# EAGLE design BRD161224 (EAGLE 8.2.2)
BOARD: BLE2 click
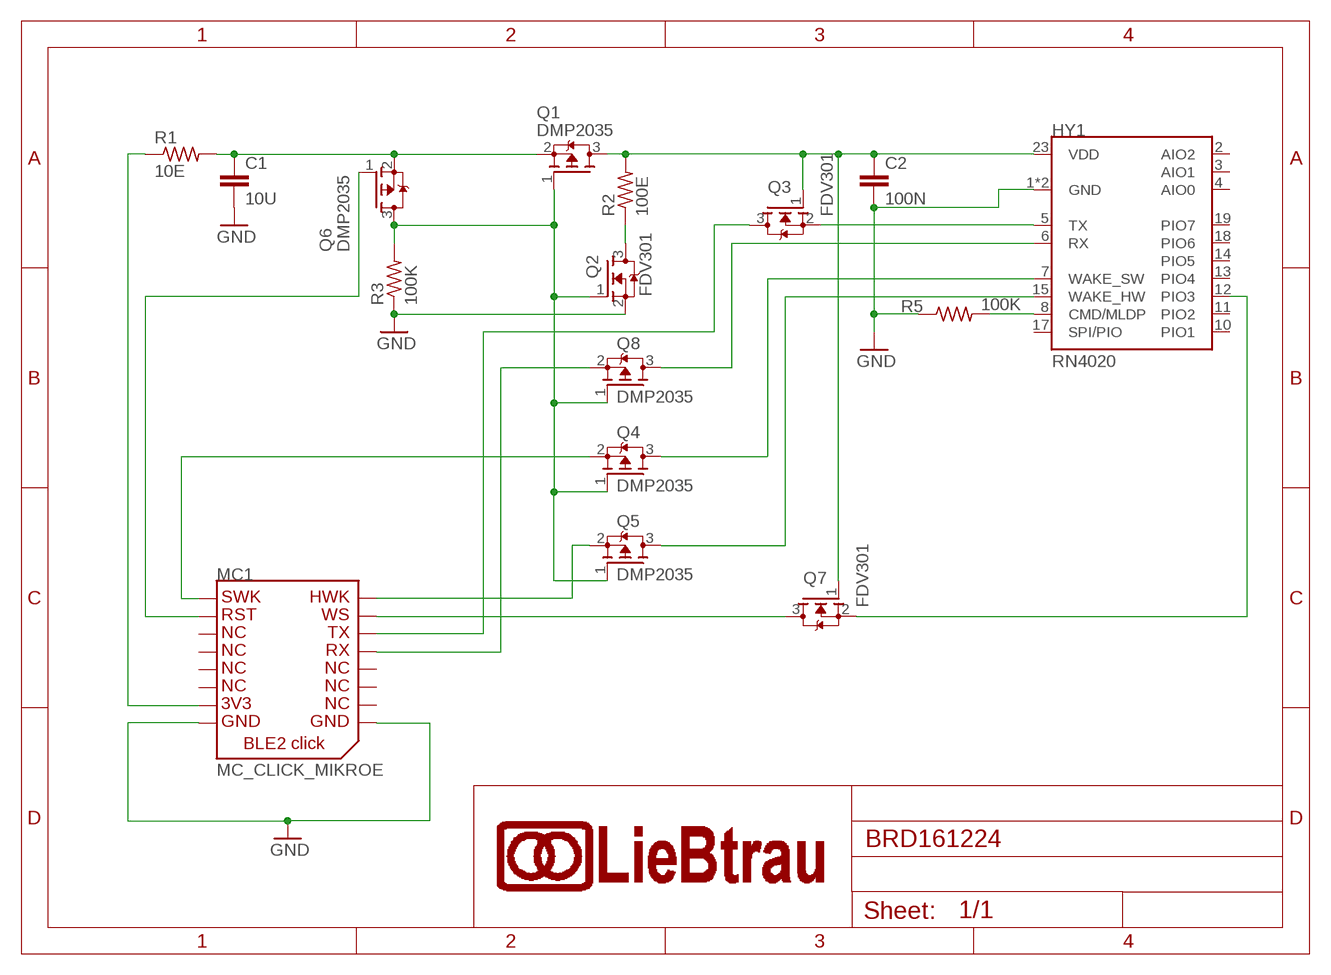
[diagram p0: schematic, sheet 1]
U$1 (SY_FRAMEA5): REV: R01.0x; TITLE: BLE2 click

## Parts
C1  10U  CA_10U_1206  [CA_1206]
C2  100N  CA_100N_1206  [CA_1206]
HY1  RN4020  HY_RF_BLE_RN4020  [HY_BLE_RN4020]
MC1  MC_CLICK_MIKROE  [MC_CLICK_MIKROE]
Q1  DMP2035  TR_PMOS_DMP2035_SOT23  [SC_SOT23]
Q2  FDV301  TR_NMOS_FDV301_SOT23  [SC_SOT23]
Q3  FDV301  TR_NMOS_FDV301_SOT23  [SC_SOT23]
Q4  DMP2035  TR_PMOS_DMP2035_SOT23  [SC_SOT23]
Q5  DMP2035  TR_PMOS_DMP2035_SOT23  [SC_SOT23]
Q6  DMP2035  TR_PMOS_DMP2035_SOT23  [SC_SOT23]
Q7  FDV301  TR_NMOS_FDV301_SOT23  [SC_SOT23]
Q8  DMP2035  TR_PMOS_DMP2035_SOT23  [SC_SOT23]
R1  10E  RE_10E_1206  [RE_1206]
R2  100E  RE_100E_1206  [RE_1206]
R3  100K  RE_100K_1206  [RE_1206]
R5  100K  RE_100K_1206  [RE_1206]

## Nets
GND: C1.2 C2.2 HY1.1(GND) HY1.24(GND) MC1.P$8 MC1.P$9 Q2.2(S) R3.1 R5.1
N$1: C1.1 Q1.2(S) Q6.2(S) R1.2
N$2: C2.1 HY1.23(VDD) Q1.3(D) Q3.1(G) Q7.1(G) R2.2
N$3: Q2.3(D) R2.1
N$4: Q1.1(G) Q2.1(G) Q4.1(G) Q5.1(G) Q6.3(D) Q8.1(G) R3.2
N$5: MC1.P$7 R1.1
N$6: MC1.P$2 Q6.1(G)
N$7: HY1.5(TX) Q3.2(S)
N$8: MC1.P$13 Q8.2(S)
N$9: MC1.P$14 Q3.3(D)
N$11: HY1.12(PIO3) Q7.2(S)
N$12: HY1.8(CMD/MLDP) R5.2
N$13: HY1.7(WAKE_SW) Q4.3(D)
N$14: HY1.15(WAKE_HW) Q5.3(D)
N$15: MC1.P$1 Q4.2(S)
N$16: HY1.6(RX) Q8.3(D)
N$17: MC1.P$16 Q5.2(S)
N$18: MC1.P$15 Q7.3(D)
Unconnected: HY1.2(AIO2) HY1.3(AIO1) HY1.4(AIO0) HY1.10(PIO1) HY1.11(PIO2) HY1.13(PIO4) HY1.14(PIO5) HY1.17(SPI/PIO) HY1.18(PIO6) HY1.19(PIO7) MC1.P$3 MC1.P$4 MC1.P$5 MC1.P$6 MC1.P$10 MC1.P$11 MC1.P$12

## Library data of the parts
C1 = lieBtrau:CA; COST: 0.27; ORDERCODE: 1276-6767-1-ND
C2 = lieBtrau:CA; COST: 0.09; ORDERCODE: 399-1249-1-ND
HY1 = lieBtrau:HY_RF_BLE_RN4020; COST: 8.57; ORDERCODE: RN4020-V/RM123-ND
MC1 = lieBtrau:MC_CLICK_MIKROE: Mikroelektronika Click board <http://www.mikroe.com/click/>; 3V3: 3V3; 5V: NC; AN: SWK; CS: NC; INT: WS; MISO: NC; MOSI: NC; PWM: HWK; RST: RST; RX: RX; SCK: NC; SCL: NC; SDA: NC; TX: TX
Q1 Q4-Q6 Q8 = lieBtrau:TR_PMOS; COST: 0.38; ORDERCODE: DMP2035U-7DICT-ND
Q2 Q3 Q7 = lieBtrau:TR_NMOS; COST: 0.21; ORDERCODE: FDV301NCT-ND
R1 = lieBtrau:RE: Yageo RC1206 Stackpole RMCF1206; COST: 0.09; ORDERCODE: P10.0FCT-ND
R2 = lieBtrau:RE: Yageo RC1206 Stackpole RMCF1206; COST: 0.09; ORDERCODE: 311-100FRCT-ND
R3 R5 = lieBtrau:RE: Yageo RC1206 Stackpole RMCF1206; COST: 0.09; ORDERCODE: 311-100KFRCT-ND

## Board
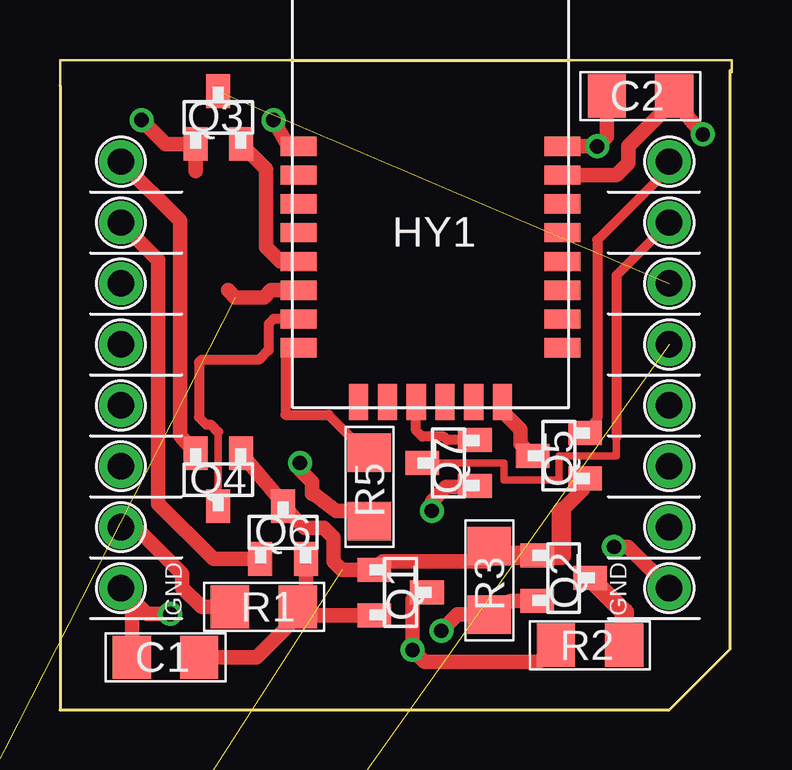
[diagram p1: board, top side]
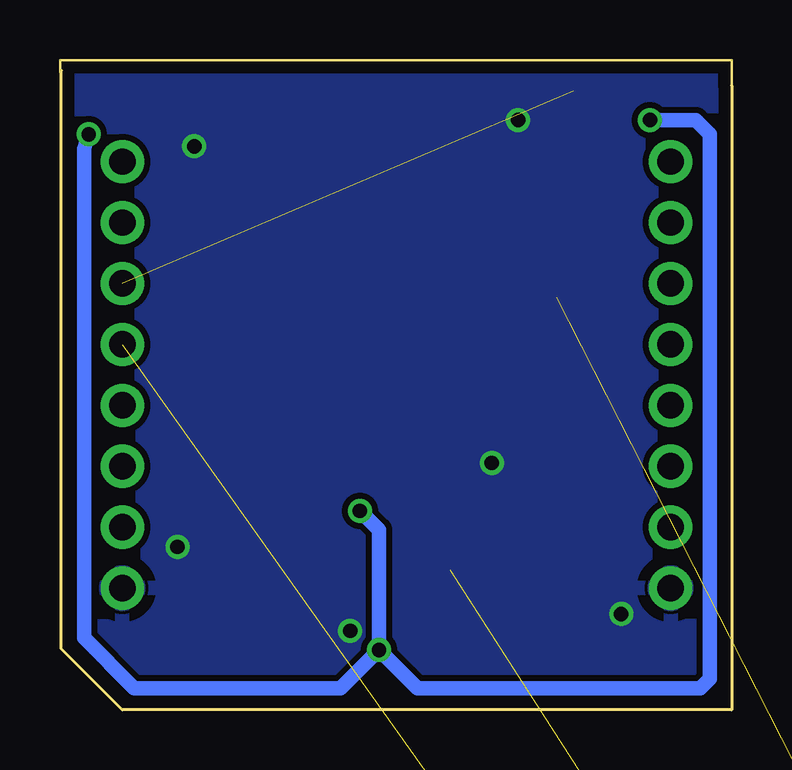
[diagram p2: board, bottom side, seen from below]

Size 28 x 27.1 mm. Coordinates in mm from the lower left corner, seen from the top.
Outline: 0,26.1 0,27.1 28,27.1 28,26.6
Copper layers (1*16): Top 0.035mm / dielectric 1.5mm / Bottom 0.035mm
Design rules "dtron": minimum track width 0.175mm, minimum drill 0.6mm, track to track 0.25mm, track to pad 0.25mm, pad to pad 0.2mm, via to via 0.25mm, smd to smd 0.2mm, copper to edge 0.5mm, drill to drill 0.2mm, minimum pad ring 0.25mm, minimum via ring 0.2mm, stop-mask expansion 0.1mm, vias tented up to drill 0mil, thermal gap 0.5mm

### Footprints (pad centres in the part's own frame; a part is rotated, then mirrored left to right if it is on the bottom)
CA_1206 = smd 1.6 x 1.8: 1 -1.4,0; 2 1.4,0
HY_BLE_RN4020 = smd 1.5 x 0.8: 1 0.25,10.9; 2 0.25,9.7; 3 0.25,8.5; 4 0.25,7.3; 5 0.25,6.1; 6 0.25,4.9; 7 0.25,3.7; 8 0.25,2.5; 17 11.25,2.5; 18 11.25,3.7; 19 11.25,4.9; 20 11.25,6.1; 21 11.25,7.3; 22 11.25,8.5; 23 11.25,9.7; 24 11.25,10.9 | smd 0.8 x 1.5: 10 2.75,0.25; 11 3.95,0.25; 12 5.15,0.25; 13 6.35,0.25; 14 7.55,0.25; 15 8.75,0.25
MC_CLICK_MIKROE = drill 1.1 pad 1.8: P$1 -11.43,17.78; P$2 -11.43,15.24; P$3 -11.43,12.7; P$4 -11.43,10.16; P$5 -11.43,7.62; P$6 -11.43,5.08; P$7 -11.43,2.54; P$8 -11.43,0; P$9 11.43,0; P$10 11.43,2.54; P$11 11.43,5.08; P$12 11.43,7.62; P$13 11.43,10.16; P$14 11.43,12.7; P$15 11.43,15.24; P$16 11.43,17.78
SC_SOT23 = smd 1 x 1.4: 1 -0.95,-1.1; 2 0.95,-1.1; 3 0,1.1
RE_1206 = smd 1.6 x 1.803: 1 -1.422,0; 2 1.422,0

### Placement (x,y rotation side)
C1  4.4,2.2 180 top
C2  24.2,25.6 180 top
DRILEGEND  [DRILEGEND]  34.18,23.67 0 top  (outside the outline)
HY1  9.7,12.6 0 top
MC1  13.97,5.08 0 top
Q1  14.2,4.9 270 top
Q2  21,5.5 270 top
Q3  6.6,24.7 0 top
Q4  6.6,9.6 180 top
Q5  20.8,10.6 90 top
Q6  9.3,7.4 0 top
Q7  16.2,10.3 90 top
Q8  -35.9,-68.6 0 top  (outside the outline)
R1  8.5,4.3 0 top
R2  22.1,2.7 180 top
R3  17.9,5.4 90 top
R5  12.9,9.3 90 top
U$2  [MC_FRAME_A5]  -37.3,-63.9 0 top  (outside the outline)

### Tracks (layer width: path | path; a pad name or v marks a point on that pad's centre or on a via)
GND  (via drill 0.6)
  Top 0.61: HY1.1 9.5,23.5 v8.9,24.6 | C1.2 3,4.62 MC1.P$8 3.62,4 v4.6,4 | HY1.24 v22.4,23.5 22.8,23.9 C2.2 | R5.1 12.72,7.88 12.3,8.3 11.5,8.3 10.6,9 10.5,9 10.5,9.5 10,10 v10,10.3 | Q2.2 18.77,4.55 R3.1 16.58,3.98 v15.9,3.3 | MC1.P$9 23.68,6.8 v23.1,6.8
  pour Bottom: -1.4,-0.9 -1.5,28.1 29.8,28.2 29.8,3.6 25.9,-1.1
N$1
  Top 0.61: C1.1 8.2,2.2 9.92,3.92 R1.2 | Q6.2 10.25,4.63 arc-90 R1.2 | Q1.2 10.27,3.95 arc-90 R1.2
N$2  (via drill 0.6)
  Top 0.61: 5.65,22.47 Q3.1 4.4,23.6 v3.4,24.6 | R2.2 19.98,2 15.2,2 v14.7,2.5 14.7,4.6 Q1.3 | v26.8,24 25.7,25.3 C2.1 25.6,25.4 23.7,23.5 23.7,22.8 23.2,22.3 HY1.23 | v15.5,8.3 15.5,8.7 16.1,9.3 17.25,9.3 Q7.1
  Bottom 0.61: v15.5,8.3 14.7,7.5 v14.7,2.5 | v26.8,24 27,23.4 27,3 24.9,0.9 16.3,0.9 v14.7,2.5 | v14.7,2.5 13.1,0.9 1.3,0.9 0.9,1.3 0.9,24 1.5,24.6 v3.4,24.6
N$3
  Top 0.813: Q2.3 23.52,4.08 R2.1
N$4  (1 unrouted)
  Top 0.406: Q4.1 7.65,10.35
  Top 0.61: 20.9,8.25 20.9,8.3 21.8,9.2 Q5.1 | 17.8,6.5 R3.2 17.8,6.2 13.45,6.2 Q1.1 11.75,5.85 11.4,6.2 11.4,7.2 11,7.6 10.2,7.6 Q6.3 9.15,8.8 Q4.1
  Top 0.813: R3.2 18.37,6.45 Q2.1 20.9,6.45 20.9,8.25
N$5
  Top 0.61: MC1.P$7 3.16,7.62 5.1,5.68 5.1,5.1 5.9,4.3 R1.1
N$6
  Top 0.61: MC1.P$2 4.1,18.76 4.1,8.6 6.4,6.3 Q6.1
N$7
  Top 0.61: HY1.5 9.2,18.7 8.6,19.3 8.6,22.55 Q3.2
N$8  (1 unrouted)
N$9  (1 unrouted)
N$11
  Top 0.406: Q7.2 16.15,11.25 16,11.4 15.1,11.4 14.85,11.65 HY1.12
N$12
  Top 0.406: HY1.8 9.4,15.1 9.4,12.3 11.2,12.3 13,10.5 13.18,10.32
  Top 0.61: R5.2 12.9,10.6 13,10.5
N$13
  Top 0.305: 6.6,11.6 Q4.3
  Top 0.406: HY1.7 8.9,16.3 8.7,16.1 8.7,15 8.3,14.6 5.9,14.6 5.8,14.5 5.8,12.2 6.1,11.9 6.3,11.9 6.6,11.6
N$14
  Top 0.61: HY1.15 18.45,12.45 19.2,11.7 19.2,11.1 Q5.3
N$15
  Top 0.61: MC1.P$1 5,20.4 5,11.45 Q4.2
N$16  (1 unrouted)
  Top 0.61: HY1.6 8.8,17.5 8.5,17.2 7.3,17.2 7,17.5
N$17
  Top 0.406: MC1.P$16 25.4,22.6 22.4,19.6 22.4,12.15 Q5.2
N$18
  Top 0.305: 23.2,11.4 23.2,10.6 20.8,10.6 20.8,9.6 18.5,9.6 18.5,10.3 Q7.3
  Top 0.406: MC1.P$15 23.2,18.12 23.2,11.4